# EAGLE design Pi Board (EAGLE 7.7.0)
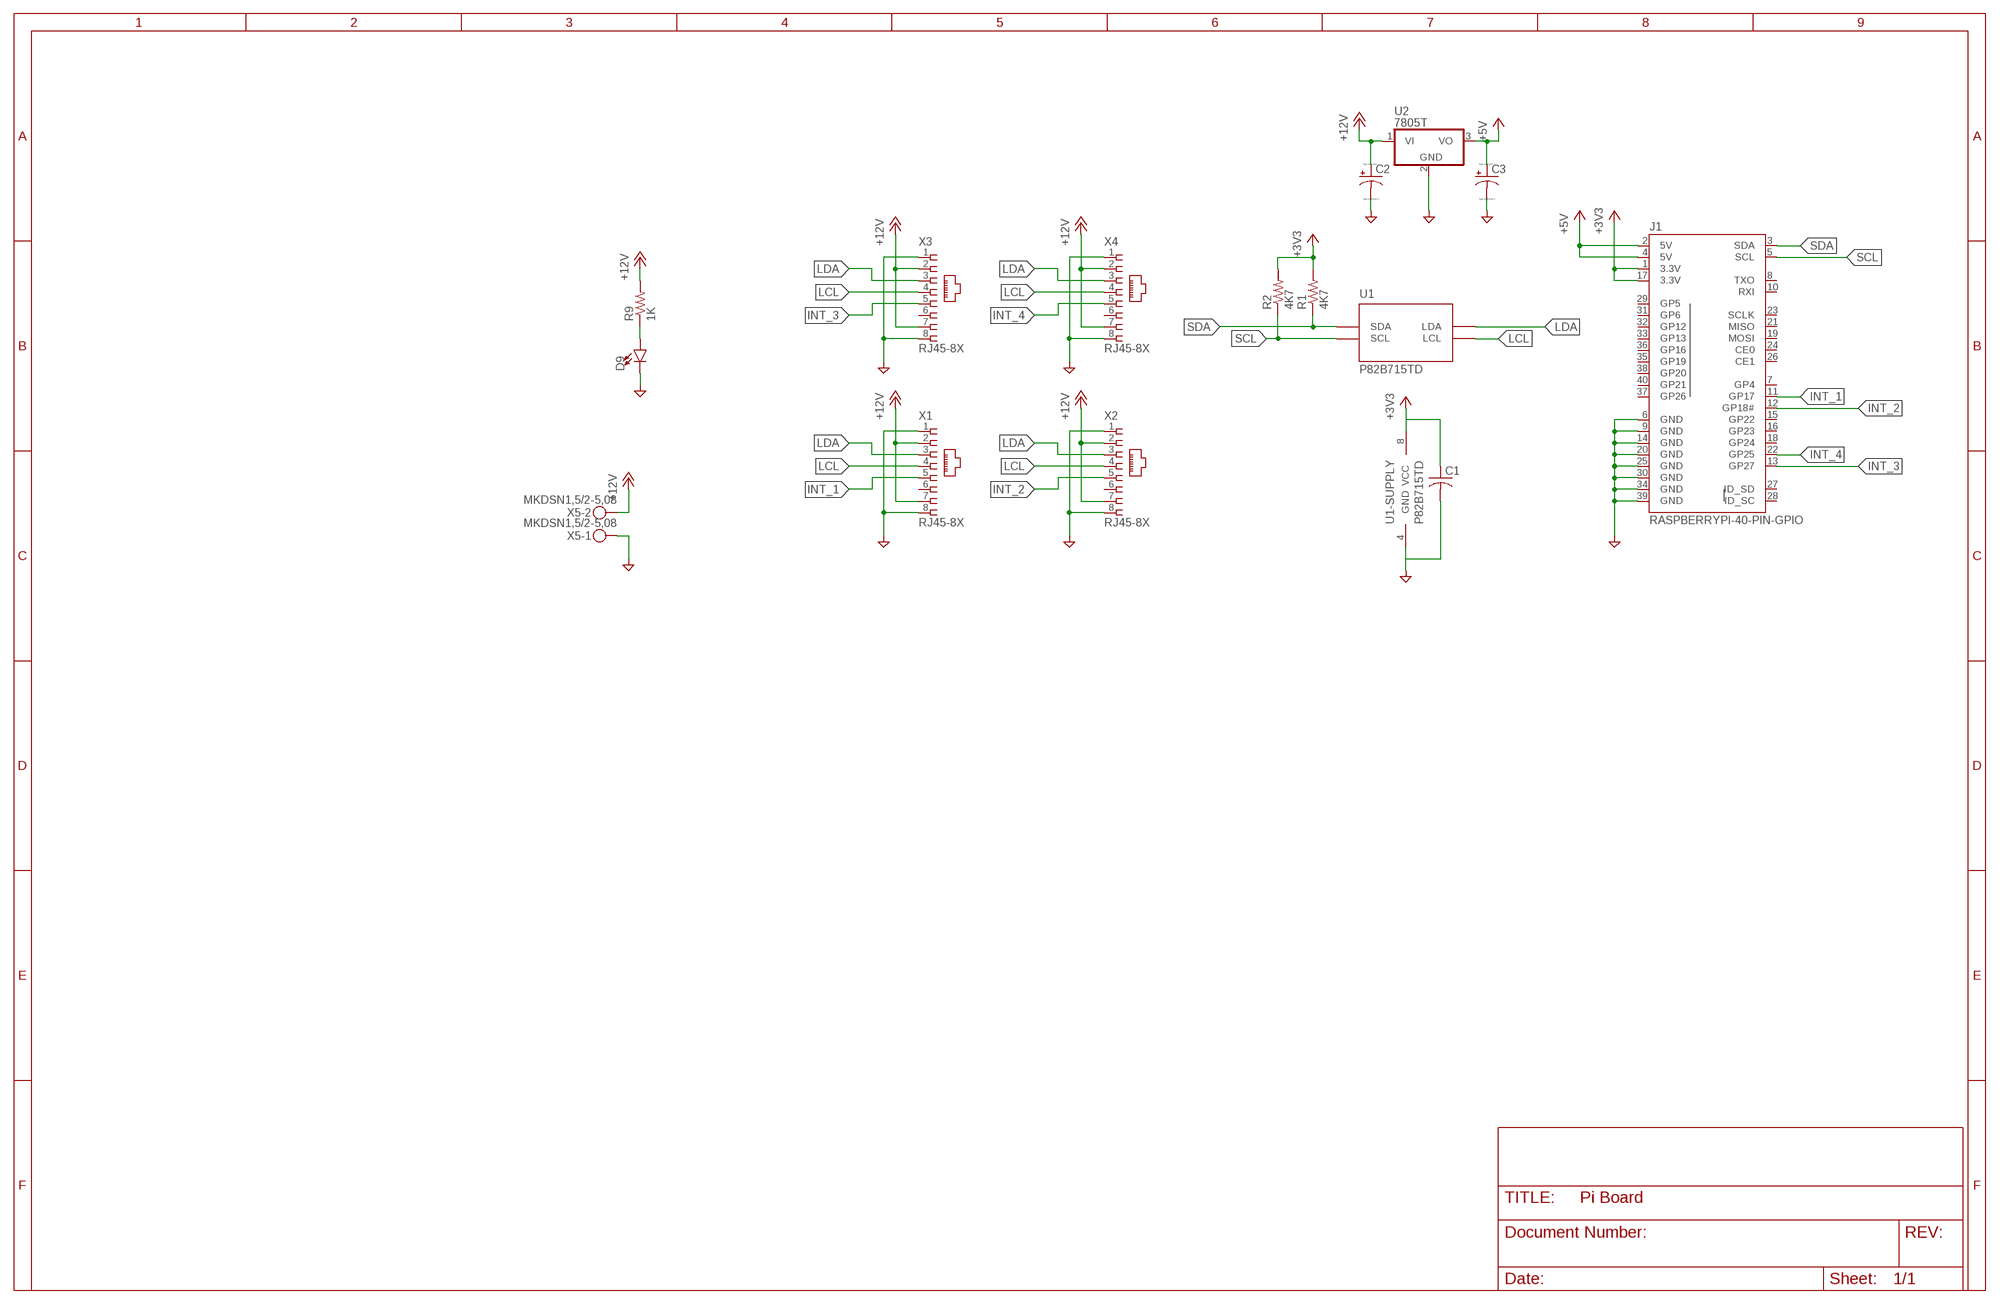
[diagram p0: schematic, sheet 1]

## Parts
C1  C-USC0805  [C0805]
C2  CPOL-USC  [PANASONIC_C]
C3  CPOL-USC  [PANASONIC_C]
D9  LED3MM  [LED_3MM]
J1  RASPBERRYPI-40-PIN-GPIO  [2X20-SHROUDED]
R1  4K7  R-US_R0805  [R0805]
R2  4K7  R-US_R0805  [R0805]
R9  1K  R-US_R0805  [R0805]
U1  P82B715TD  [SOIC-8]
U2  7805T  [TO220H]
X1  RJ45-8X  [RJ45-NO-SHIELD]
X2  RJ45-8X  [RJ45-NO-SHIELD]
X3  RJ45-8X  [RJ45-NO-SHIELD]
X4  RJ45-8X  [RJ45-NO-SHIELD]
X5  MKDSN1,5/2-5,08  [MKDSN1,5/2-5,08]

## Nets
+3V3: C1.1 J1.1(3.3V) J1.17(3.3V) R1.2 R2.2 U1.8(VCC)
+5V: C3.+ J1.2(5V) J1.4(5V) U2.3(VO)
+12VBUS: C2.+ R9.2 U2.1(VI) X1.2 X1.7 X2.2 X2.7 X3.2 X3.7 X4.2 X4.7 X5.2 ; supply symbol labelled +12V
DGND: C1.2 C2.- C3.- D9.K(C) J1.6(GND) J1.9(GND) J1.14(GND) J1.20(GND) J1.25(GND) J1.30(GND) J1.34(GND) J1.39(GND) U1.4(GND) U2.2(GND) X1.1 X1.8 X2.1 X2.8 X3.1 X3.8 X4.1 X4.8 X5.1 ; supply symbol labelled VDG
INT_1: J1.11(GP17) X1.5
INT_2: J1.12(GP18#) X2.5
INT_3: J1.13(GP27) X3.5
INT_4: J1.22(GP25) X4.5
LCL: U1.2(LCL) X1.4 X2.4 X3.4 X4.4
LDA: U1.7(LDA) X1.3 X2.3 X3.3 X4.3
N$15: D9.A R9.1
SCL: J1.5(SCL) R2.1 U1.3(SCL)
SDA: J1.3(SDA) R1.1 U1.6(SDA)
Unconnected: J1.7(GP4) J1.8(TXO) J1.10(RXI) J1.15(GP22) J1.16(GP23) J1.18(GP24) J1.19(MOSI) J1.21(MISO) J1.23(SCLK) J1.24(CE0) J1.26(CE1) J1.27(ID_SD) J1.28(ID_SC) J1.29(GP5) J1.31(GP6) J1.32(GP12) J1.33(GP13) J1.35(GP19) J1.36(GP16) J1.37(GP26) J1.38(GP20) J1.40(GP21) X1.6 X2.6 X3.6 X4.6

## Library data of the parts
C1 = rcl:C-US: CAPACITOR, American symbol
C2 C3 = resistor:CPOL-US: POLARIZED CAPACITOR, American symbol
D9 = SparkFun-LED 2:LED: LED (Generic) Standard schematic elements and footprints for 5mm, 3mm, 1206, and 0603 sized LEDs. Generic LEDs with no color specified.; PROD_ID: DIO-08794
J1 = SparkFun-Boards:RASPBERRYPI-40-PIN-GPIO: Second Generation Raspberry Pi GPIO Header 2x20 pin connector, as found on B, B+, A+ models.
R1 R2 R9 = resistor:R-US_: RESISTOR, American symbol
U1 = Volks73-NXPSemiconductors:P82B715?: I2C-Bus Extender I2C-bus extender Documentation Datasheet <http://www.nxp.com/documents/data_sheet/P82B715.pdf> General Description The P82B715 is a bipolar IC intended for application in I2C-bus and derivative bus systems. While retaining all the operating modes and features of the I2C-bus it permits extension of the practical separation distance between components on the I2C-bus by buffering both the data (SDA) and the clock (SCL) lines. The I2C-bus capacitance limit of 400 pF restricts practical communication distances to a few meters. Using one P82B715 at each end of a long cable (connecting Lx/Ly to Lx/Ly) reduces that cable’s loading on the linked I2C-buses by a factor of 10 and allows the total system capacitance load (all devices, cable, connectors, and traces or wires connected to the I2C-bus) to be around 3000 pF while the loading on each I2C-bus on the Sx/Sy sides remains below 400 pF. Longer cables or low-cost, general-purpose wiring may be used to link I2C-bus based modules without degrading noise margins. Multiple P82B715s can be connected together, linking their Lx/Ly ports, in a star or multi-point architecture as long as the total capacitance of the system is less than about 3000 pF and each bus at an Sx/Sy connection is well below 400 pF. This configuration, with the master and/or slave devices attached to the Sx/Sy port of each P82B715, has full multi-master communication capability. The P82B715 alone does not support voltage level translation, but it can be simply implemented using low cost transistors when required. There is no restriction on interconnecting the Sx/Sy I/Os, and, because the device output levels are always held within 100 mV of input drive levels, P82B715 is compatible with bus buffers that use voltage level offsets, e.g., PCA9511A, PCA9517, Sx/Sy side of P82B96. The lower VOL level and ability to operate with any master, slave or bus buffer is the primary advantage of the using the P82B715 for long distance buses at the disadvantage of not isolating bus capacitance like the P82B96 or PCA9600 are able to do. The primary disadvantage of the P82B96 and PCA9600 is that the static level offset needed to isolate bus capacitance does not allow these devices to operate with other bus buffers with special offset levels or with master/slaves that require a VIL lower than 0.8 V with noise margin. A proven quick design-in point-to-point/multi-point circuit (Figure 9) is included in Section 8.2 to allow rapid use of the P82B715 along with comparison waveforms so that the designer can clearly see the trade-offs between the P82B715 and the P82B96/PCA9600 and choose the type of device that is best for their application. Features Dual, bidirectional, unity voltage gain buffer with no external directional control required Compatible with I2C-bus and its derivatives SMBus, PMBus, DDC, etc. Logic signal levels may include (but not exceed) both supply and ground Logic signal input voltage levels are output without change and are independent of VCC ×10 impedance transformation, but does not change logic voltage levels Supply voltage range 3 V to 12 V Clock speeds to at least 100 kHz and 400 kHz when other system delays permit ESD protection exceeds 2500 V HBM per Mil. Std 883C-3015.7 and 400 V MM per JESD22-A115 (I/Os have diodes to VCC and GND) Latch-up testing is done to JEDEC Standard JESD78 which exceeds 100 mA Applications Increase the total connected capacitance of an I2C-bus system to around 3000 pF Drive I2C-bus signals over long cables to approximately 50 meters or 3000 pF Drives ×10 lower impedance bus wiring for improved noise immunity Multi-drop distribution of I2C-bus signals using low cost twisted-pair cables AdvancedTCA radial IPMB architecture Driving 30 mA Fm+ devices from standard 3 mA parts; APPLICATIONS: I2C; CAPACITANCE-INPUT: 3000pF; CURRENT_SUPPLY: 22mA; DATA_RATE: 400kHz; DELAY_TIME: -; DESCRIPTION: IC REDRIVER I2C 1CH 400KHZ 8SO; DOCUMENTATION_LINK: <a href="http://www.nxp.com/documents/data_sheet/P82B715.pdf">Datasheet</a>; DOCUMENTATION_URL: http://www.nxp.com/documents/data_sheet/P82B715.pdf; INPUT: 2-Wire Buse; MANUFACTURER: NXP Semiconductors; NUMBER_OF_CHANNELS: 1; OPERATING_TEMPERATURE: -40C ~ 85C; OUTPUT: 2-Wire Bus; PART_NUMBER: P82B715TD,118; SIGNAL_CONDITIONING: -; SUPPLIER_ITEM_LINK: <a href="http://www.digikey.com/product-detail/en/P82B715TD,118/568-1007-2-ND/735621">Details</a>; SUPPLIER_ITEM_NUMBER: 568-1007-2-ND; SUPPLIER_ITEM_URL: http://www.digikey.com/product-detail/en/P82B715TD,118/568-1007-2-ND/735621; SUPPLIER_LINK: <a href="http://www.digikey.com">Home Page</a>; SUPPLIER_NAME: Digi-Key; SUPPLIER_URL: http://www.digikey.com; TYPE: Buffer, ReDriver; VOLTAGE_SUPPLY: 4.5V ~ 12V
U2 = linear:78*: Positive VOLTAGE REGULATOR Source: http://cache.national.com/ds/LM/LM78L05.pdf http://www.fairchildsemi.com/ds/LM/LM7805.pdf
X1-X4 = con-tycoelectronics:RJ45: CORCOM Modular RJ Jacks No Shield Source: www.tycoelectronics.com .. ENG_DS_1654001_1099_RJ_L_0507.pdf; MPN: RJ45-8X; OC_FARNELL: unknown; OC_NEWARK: 16R6101
X5 = con-phoenix-508:MKDSN1,5/2-5,08: MKDSN 1,5/ 2-5,08 Printklemme Nennstrom: 13,5 A Nennspannung: 250 V Rastermaß: 5,08 mm Polzahl: 2 Anschlussart: Schraubanschluss Montage: Löten Anschlussrichtung Leiter/Platine: 0 ° Artikelnummer: 1729128 Source: http://eshop.phoenixcontact.com .. 1729128.pdf

## Board
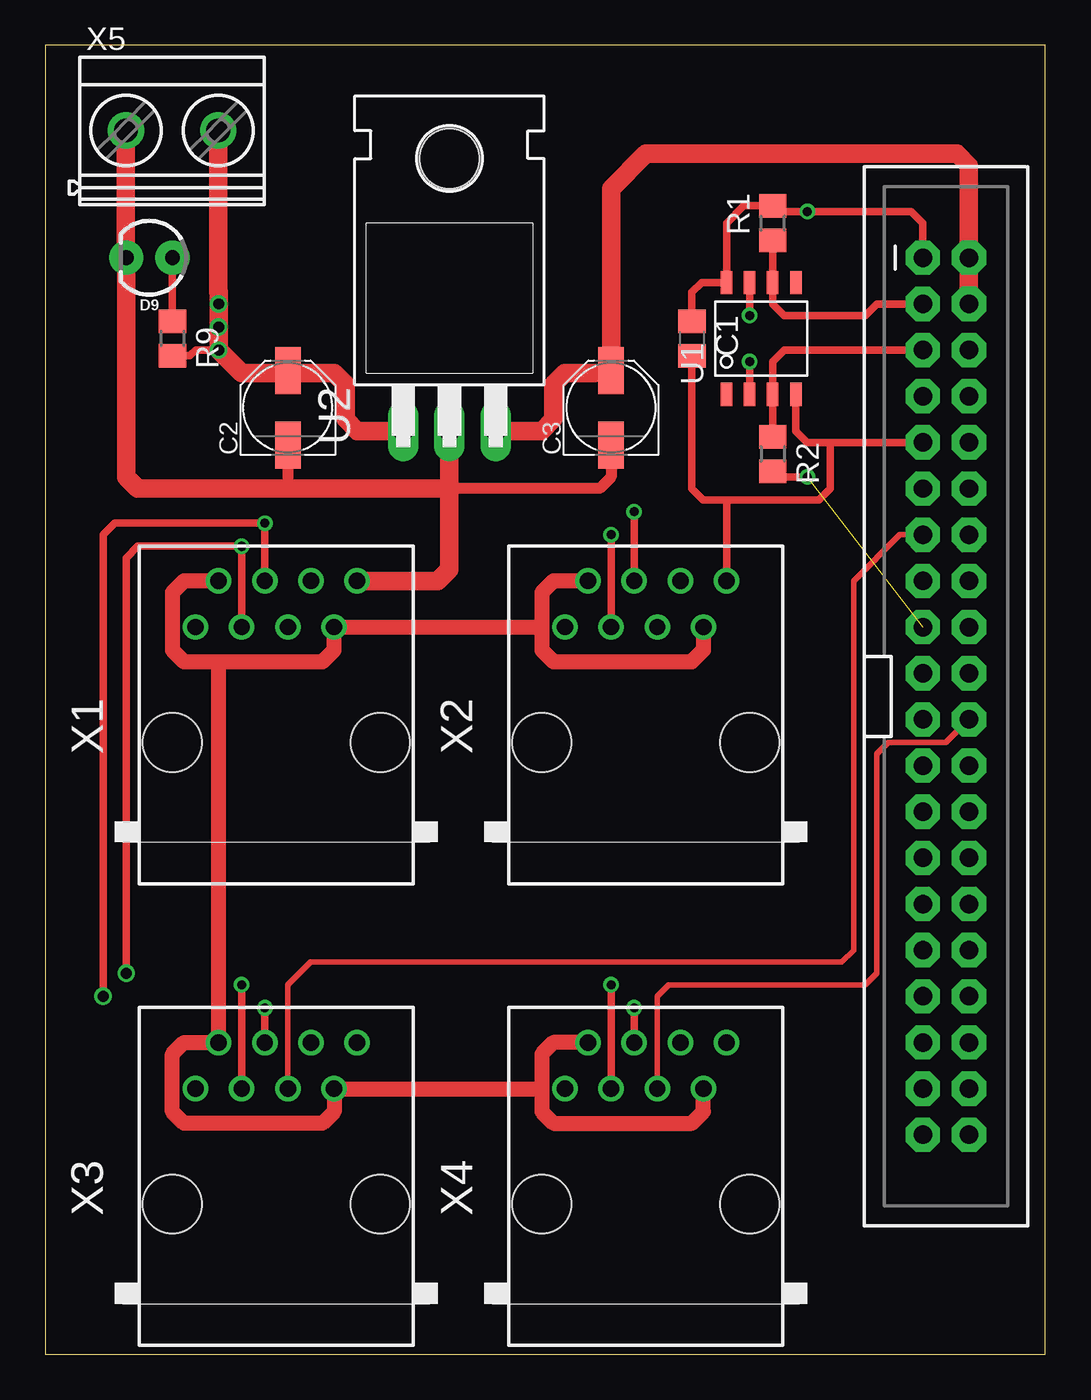
[diagram p1: board, top side]
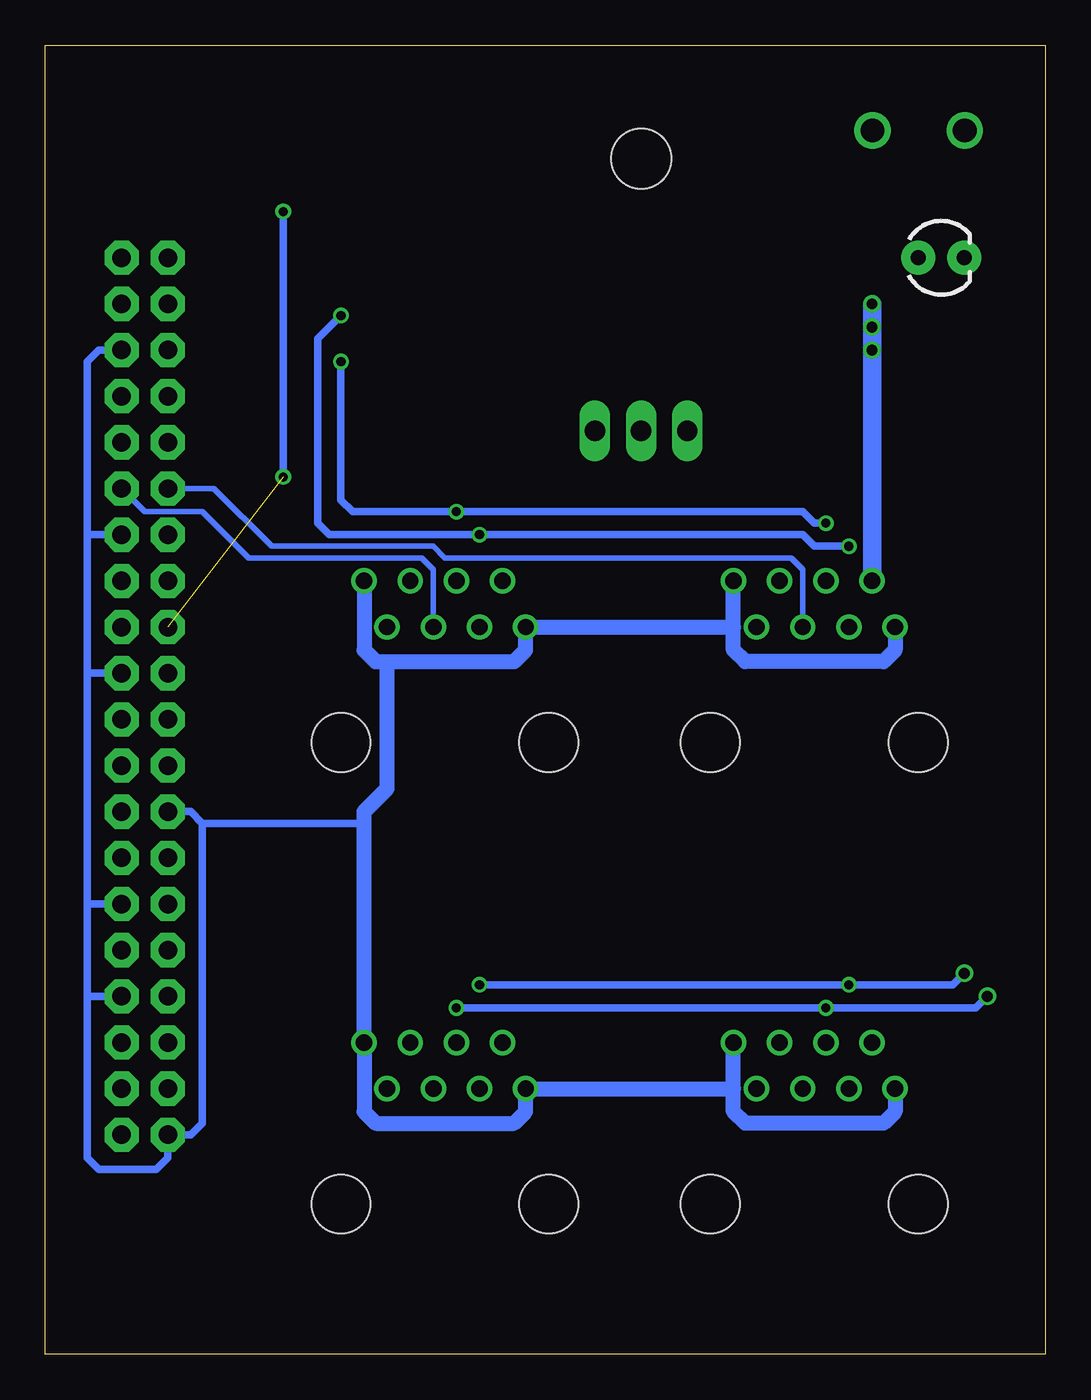
[diagram p2: board, bottom side, seen from below]

Size 54.99 x 72.01 mm. Coordinates in mm from the lower left corner, seen from the top.
Outline: 0,0 54.99,0 54.99,72.01 0,72.01 0,0
Copper layers (1*16): Top 0.0356mm / dielectric 1.5011mm / Bottom 0.0356mm
Design rules "oshpark-2layer": minimum track width 6mil, minimum drill 13mil, track to track 6mil, track to pad 6mil, pad to pad 6mil, via to via 6mil, smd to smd 6mil, copper to edge 15mil, drill to drill 6mil, minimum pad ring 7mil, minimum via ring 7mil, stop-mask expansion 2.5mil, vias tented up to drill 0mil, thermal gap 10mil

### Footprints (pad centres in the part's own frame; a part is rotated, then mirrored left to right if it is on the bottom)
C0805 = smd 1.3 x 1.5: 1 -0.95,0; 2 0.95,0
PANASONIC_C = smd 2.6 x 1.4: + 2.05,0; - -2.05,0
LED_3MM = drill 0.813 pad 1.88: A -1.27,0; K 1.27,0
2X20-SHROUDED = drill 1.016 pad 1.88 octagon: 1 -1.27,24.13; 2 1.27,24.13; 3 -1.27,21.59; 4 1.27,21.59; 5 -1.27,19.05; 6 1.27,19.05; 7 -1.27,16.51; 8 1.27,16.51; 9 -1.27,13.97; 10 1.27,13.97; 11 -1.27,11.43; 12 1.27,11.43; 13 -1.27,8.89; 14 1.27,8.89; 15 -1.27,6.35; 16 1.27,6.35; 17 -1.27,3.81; 18 1.27,3.81; 19 -1.27,1.27; 20 1.27,1.27; 21 -1.27,-1.27; 22 1.27,-1.27; 23 -1.27,-3.81; 24 1.27,-3.81; 25 -1.27,-6.35; 26 1.27,-6.35; 27 -1.27,-8.89; 28 1.27,-8.89; 29 -1.27,-11.43; 30 1.27,-11.43; 31 -1.27,-13.97; 32 1.27,-13.97; 33 -1.27,-16.51; 34 1.27,-16.51; 35 -1.27,-19.05; 36 1.27,-19.05; 37 -1.27,-21.59; 38 1.27,-21.59; 39 -1.27,-24.13; 40 1.27,-24.13
R0805 = smd 1.3 x 1.5: 1 -0.95,0; 2 0.95,0
SOIC-8 = smd 1.27 x 0.635: 1 -3.073,1.905; 2 -3.073,0.635; 3 -3.073,-0.635; 4 -3.073,-1.905; 5 3.073,-1.905; 6 3.073,-0.635; 7 3.073,0.635; 8 3.073,1.905
TO220H = drill 1.118 long: 1 -2.54,-10.16; 2 0,-10.16; 3 2.54,-10.16 | hole 3.302: 0,4.826
RJ45-NO-SHIELD = drill 0.9 pad 1.4: 1 -4.445,6.35; 2 -3.175,8.89; 3 -1.905,6.35; 4 -0.635,8.89; 5 0.635,6.35; 6 1.905,8.89; 7 3.175,6.35; 8 4.445,8.89 | hole 3.251: -5.715,0; 5.715,0
MKDSN1,5/2-5,08 = drill 1.3 pad 2: 1 -2.561,0.025; 2 2.519,0.025

### Placement (x,y rotation side)
C1  35.56,55.88 270 top
C2  13.34,52.07 90 top
C3  31.11,52.07 90 top
D9  5.71,60.33 180 top
J1  49.53,36.2 0 top
R1  40.01,62.23 90 top
R2  40.01,49.53 270 top
R9  6.99,55.88 270 top
U1  39.37,55.88 90 top
U2  22.23,60.96 0 top
X1  12.7,33.66 0 top
X2  33.02,33.66 0 top
X3  12.7,8.26 0 top
X4  33.02,8.26 0 top
X5  6.99,67.31 0 top

### Tracks (layer width: path | path; a pad name or v marks a point on that pad's centre or on a via)
+3V3  (via drill 0.5)  (1 unrouted)
  Top 0.406: J1.1 48.26,62.23 47.62,62.87 42.55,62.87 v41.91,62.87 40.32,62.87 R1.2 38.41,63.18 37.47,62.23 U1.8 36.09,58.95 35.56,58.42 C1.1 | R2.2 40.01,48.26 v41.91,48.26
  Bottom 0.406: v41.91,48.26 v41.91,62.87
+5V
  Top 0.813: 30.18,53.98 C3.+
  Top 1.016: J1.4 J1.2 50.8,65.41 50.16,66.04 33.02,66.04 31.11,64.14 C3.+ | U2.3 27.3,50.8 27.94,51.44 27.94,53.34 28.57,53.98 30.18,53.98
+12VBUS  (via drill 0.6)
  Top 0.406: R9.2 7.94,54.93 8.26,55.24 v9.53,55.24
  Top 0.813: X1.2 7.62,42.55 6.99,41.91 6.99,38.73 7.62,38.1 9.53,38.1 | 9.53,38.1 15.24,38.1 15.88,38.73 X1.7 27.3,40.01 | X4.2 27.94,17.14 27.3,16.51 27.3,14.61 | 27.3,14.61 27.3,13.34 27.94,12.7 35.56,12.7 36.2,13.34 X4.7 | X2.2 27.94,42.55 27.3,41.91 27.3,40.01 | 27.3,40.01 27.3,38.73 27.94,38.1 35.56,38.1 36.2,38.73 X2.7 | 27.3,14.61 X3.7 15.88,13.34 15.24,12.7 7.62,12.7 6.99,13.34 6.99,16.51 7.62,17.14 X3.2 9.53,38.1
  Top 1.016: U2.1 17.14,50.8 16.51,51.44 16.51,53.34 15.88,53.98 13.82,53.98 | 13.64,53.98 C2.+ 13.82,53.98 | X5.2 9.5,58.44 9.53,58.42 v9.53,57.78 v9.53,56.52 v9.53,55.24 10.79,53.98 13.64,53.98 | 13.64,53.98 13.82,53.98
  Bottom 1.016: X1.2 v9.53,57.78
DGND
  Top 0.406: J1.9 43.18,50.16 | 43.18,50.16 41.91,50.16 41.27,50.8 U1.4 | C1.2 35.56,47.62 36.2,46.99 37.47,46.99 | 37.47,46.99 42.55,46.99 43.18,47.62 43.18,50.16 | X2.8 37.47,46.99
  Top 0.61: 4.42,60.35 D9.K | C2.- 13.34,47.62 | C3.- 31.11,48.26 30.48,47.62 22.23,47.62
  Top 1.016: U2.2 22.23,47.62 | 22.23,47.62 22.23,43.18 21.59,42.55 X1.8 | X5.1 4.42,60.35 | D9.K 4.45,48.26 5.08,47.62 13.34,47.62 22.23,47.62
  Bottom 0.406: J1.25 46.99,29.84 46.35,29.21 | 46.35,29.21 46.35,12.7 46.99,12.06 J1.39 48.26,10.79 48.9,10.16 52.07,10.16 52.7,10.79 52.7,19.68 | J1.34 52.7,19.68 | 52.7,19.68 52.7,24.77 | 52.7,24.77 52.7,37.47 | 52.7,37.47 52.7,45.09 | 52.7,45.09 52.7,54.61 52.07,55.24 J1.6 | J1.14 52.7,45.09 | J1.20 52.7,37.47 | J1.30 52.7,24.77 | 46.35,29.21 37.47,29.21
  Bottom 0.813: X1.1 8.26,38.73 8.89,38.1 16.51,38.1 17.14,38.73 17.14,40.01 | 17.14,40.01 X1.8 | X3.1 8.26,13.34 8.89,12.7 16.51,12.7 17.14,13.34 17.14,14.61 | 17.14,14.61 X3.8 | X2.8 37.47,38.73 36.83,38.1 36.2,38.1 | 36.2,38.1 29.21,38.1 28.57,38.73 X2.1 17.14,40.01 | 17.14,14.61 X4.1 28.57,13.34 29.21,12.7 36.83,12.7 37.47,13.34 X4.8 37.47,29.21 37.47,29.84 36.2,31.11 36.2,38.1
INT_1
  Bottom 0.305: X1.5 13.34,43.18 13.97,43.81 33.02,43.81 33.66,44.45 42.55,44.45 45.72,47.62 J1.11
INT_2
  Bottom 0.305: X2.5 33.66,43.18 34.29,43.81 43.81,43.81 46.35,46.35 49.53,46.35 J1.12
INT_3
  Top 0.305: J1.13 46.99,45.09 44.45,42.55 44.45,22.23 43.81,21.59 14.61,21.59 13.34,20.32 X3.5
INT_4
  Top 0.305: X4.5 33.66,19.68 34.29,20.32 45.09,20.32 45.72,20.95 45.72,33.02 46.35,33.66 49.53,33.66 J1.22
LCL  (via drill 0.5, 0.6)
  Top 0.406: X1.4 v12.06,45.72 3.81,45.72 3.17,45.09 v3.17,19.68 | X2.4 v32.38,46.35 | v38.73,54.61 U1.2 | X3.4 v12.06,19.05 | X4.4 v32.38,19.05
  Bottom 0.406: v12.06,45.72 12.7,45.72 13.34,46.35 v32.38,46.35 38.1,46.35 38.73,46.99 v38.73,54.61 | v3.17,19.68 3.81,19.05 v12.06,19.05 v32.38,19.05
LDA  (via drill 0.5, 0.6)
  Top 0.406: X1.3 v10.79,44.45 5.08,44.45 4.45,43.81 v4.45,20.95 | X2.3 v31.11,45.09 | v38.73,57.15 U1.7 | X3.3 v10.79,20.32 | X4.3 v31.11,20.32
  Bottom 0.406: v10.79,44.45 12.7,44.45 13.34,45.09 v31.11,45.09 39.37,45.09 40.01,45.72 40.01,55.88 v38.73,57.15 | v4.45,20.95 5.08,20.32 v10.79,20.32 v31.11,20.32
N$15
  Top 0.406: D9.A R9.1
SCL
  Top 0.406: R2.1 U1.3 40.01,54.61 40.64,55.24 J1.5
SDA
  Top 0.406: R1.1 U1.6 40.01,57.78 40.64,57.15 45.09,57.15 45.72,57.78 J1.3